# Altium schematic sheet main.SchDoc
size A4; SheetNumber: 1; SheetTotal: 1
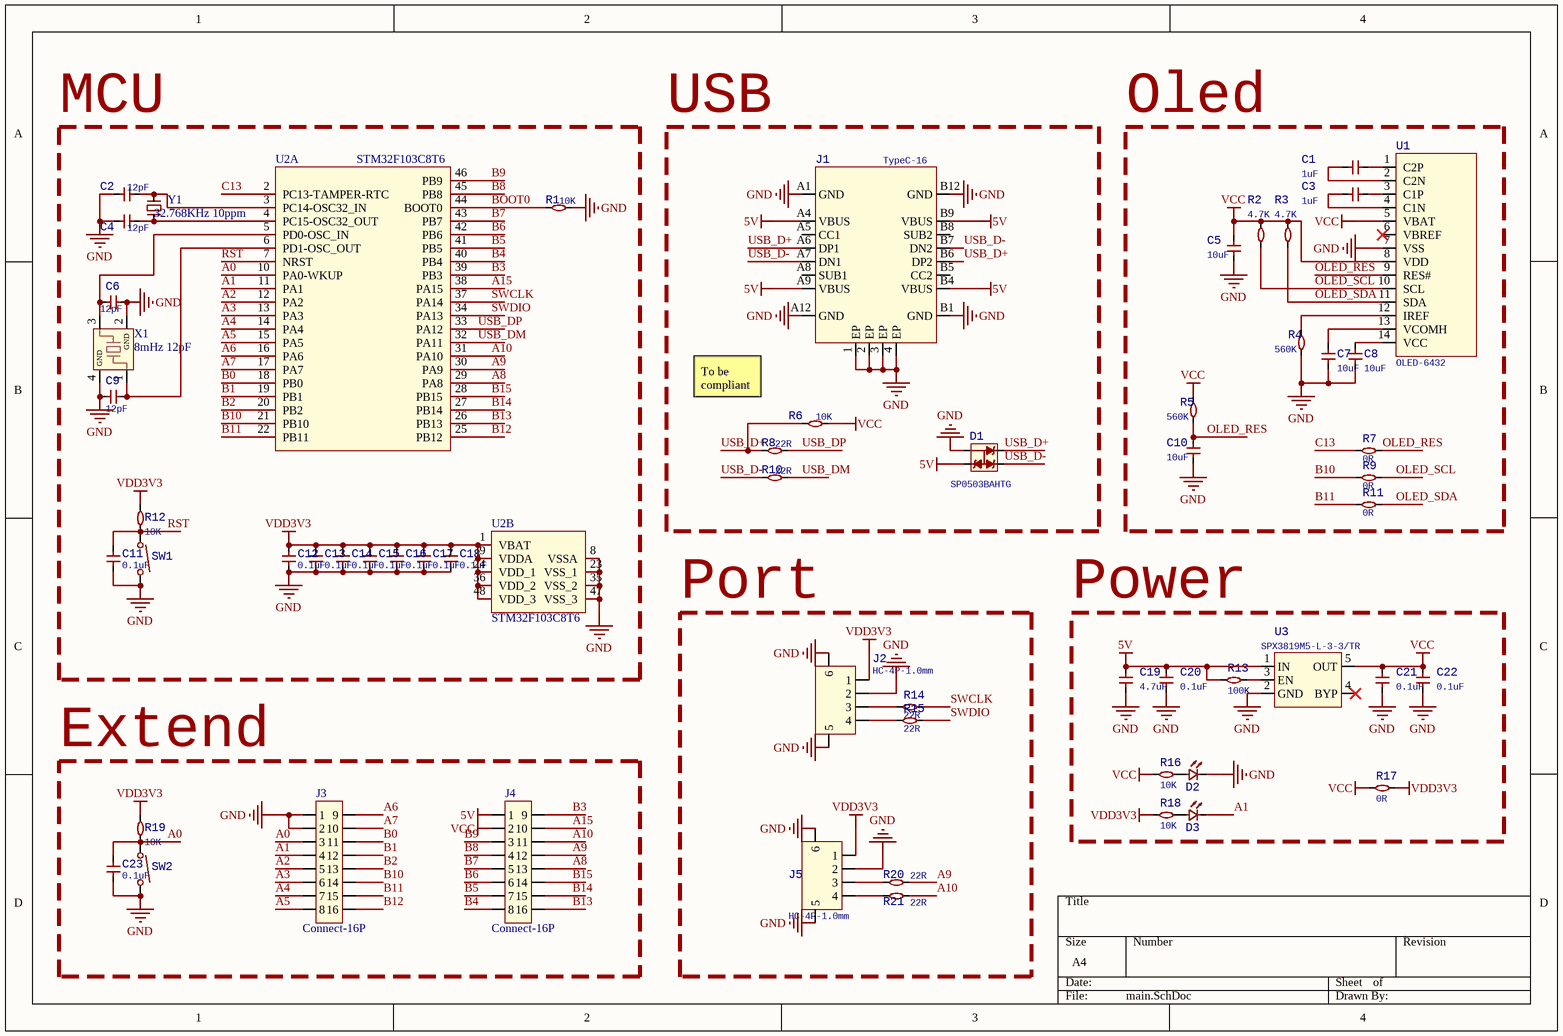
[diagram p0: main.SchDoc]

## Parts
C1  1uF  [C0402]
C2  12pF  [C0402]
C3  1uF  [C0402]
C4  12pF  [C0402]
C5  10uF  [C0402]
C6  12pF  [C0402]
C7  10uF  [C0402]
C8  10uF  [C0402]
C9  12pF  [C0402]
C10  10uF  [C0402]
C11  0.1uF  [C0402]
C12  0.1uF  [C0402]
C13  0.1uF  [C0402]
C14  0.1uF  [C0402]
C15  0.1uF  [C0402]
C16  0.1uF  [C0402]
C17  0.1uF  [C0402]
C18  0.1uF  [C0402]
C19  4.7uF  [C0402]
C20  0.1uF  [C0402]
C21  0.1uF  [C0402]
C22  0.1uF  [C0402]
C23  0.1uF  [C0402]
D1  SP0503BAHTG  [SOT-143]
D2  LED  [LED-0402]  (value not drawn)
D3  LED  [LED-0402]  (value not drawn)
J1  TypeC-16  [USB-SMD_TYPE-C-16P]
J2  HC-4P-1.0mm  [SMD_4P_HC-1.0]
J3  Connect-16P  [PIN-16P]
J4  Connect-16P  [PIN-16P]
J5  HC-4P-1.0mm  [SMD_4P_HC-1.0]
R1  10K  [R0402]
R2  4.7K  [R0402]
R3  4.7K  [R0402]
R4  560K  [R0402]
R5  560K  [R0402]
R6  10K  [R0402]
R7  0R  [R0402]
R8  22R  [R0402]
R9  0R  [R0402]
R10  22R  [R0402]
R11  0R  [R0402]
R12  10K  [R0402]
R13  100K  [R0402]
R14  22R  [R0402]
R15  22R  [R0402]
R16  10K  [R0402]
R17  0R  [R0402]
R18  10K  [R0402]
R19  10K  [R0402]
R20  22R  [R0402]
R21  22R  [R0402]
SW1  3*4两脚按键  [SW-SMD_L4.0-W2.9]  (value not drawn)
SW2  3*4两脚按键  [SW-SMD_L4.0-W2.9]  (value not drawn)
U1  OLED-6432  [OLED-0.96-128x64]
U2  STM32F103C8T6  [LQFP-48_L7.0-W7.0-P0.50]  (parts A,B of 2)
U3  SPX3819M5-L-3-3/TR  [SOT-23-5]
X1  8mHz 12pF  [SMD2016-4P]
Y1  32.768KHz 10ppm  [SMD_2012-2P]

## Blocks framed on the sheet
MCU: C2 C4 C6 C9 C11-C18 R1 R12 SW1 U2 X1 Y1
USB: D1 J1 R6 R8 R10
Oled: C1 C3 C5 C7 C8 C10 R2-R5 R7 R9 R11 U1
Port: J2 J5 R14 R15 R20 R21
Power: C19-C22 D2 D3 R13 R16-R18 U3
Extend: C23 J3 J4 R19 SW2

## Nets
5V: C19.1 C20.1 D1.2 J1.A4(VBUS) J1.A9(VBUS) J1.B4(VBUS) J1.B9(VBUS) J4.1 R13.2 U3.1(IN)
GND: C2.2 C4.2 C5.2 C6.1 C7.2 C8.2 C9.2 C10.2 C11.1 C12.1 C13.1 C14.1 C15.1 C16.1 C17.1 C18.1 C19.2 C20.2 C21.2 C22.2 C23.1 D1.1 D2.1 J1.1(EP) J1.2(EP) J1.3(EP) J1.4(EP) J1.A1(GND) J1.A12(GND) J1.B1(GND) J1.B12(GND) J2.2 J2.5 J2.6 J3.1 J3.2 J5.2 J5.5 J5.6 R1.1 R4.1 SW1.2 SW2.2 U1.7(VSS) U2.8(VSSA) U2.23(VSS_1) U2.35(VSS_2) U2.47(VSS_3) U3.2(GND) X1.2(GND) X1.4(GND)
VCC: C5.1 C21.1 C22.1 J4.2 R2.2 R3.2 R5.2 R6.2 R16.1 R17.1 U1.5(VBAT) U1.8(VDD) U3.5(OUT)
VDD3V3: C12.2 C13.2 C14.2 C15.2 C16.2 C17.2 C18.2 J2.1 J5.1 R12.2 R17.2 R18.1 R19.2 U2.1(VBAT) U2.9(VDDA) U2.24(VDD_1) U2.36(VDD_2) U2.48(VDD_3)
A0: C23.2 J3.3 R19.1 SW2.1 U2.10(PA0-WKUP)
A1: D3.1 J3.4 U2.11(PA1)
A2: J3.5 U2.12(PA2)
A3: J3.6 U2.13(PA3)
A4: J3.7 U2.14(PA4)
A5: J3.8 U2.15(PA5)
A6: J3.9 U2.16(PA6)
A7: J3.10 U2.17(PA7)
A8: J4.13 U2.29(PA8)
A9: J4.12 R20.2 U2.30(PA9)
A10: J4.11 R21.2 U2.31(PA10)
A15: J4.10 U2.38(PA15)
B0: J3.11 U2.18(PB0)
B1: J3.12 U2.19(PB1)
B2: J3.13 U2.20(PB2)
B3: J4.9 U2.39(PB3)
B4: J4.8 U2.40(PB4)
B5: J4.7 U2.41(PB5)
B6: J4.6 U2.42(PB6)
B7: J4.5 U2.43(PB7)
B8: J4.4 U2.45(PB8)
B9: J4.3 U2.46(PB9)
B10: J3.14 R9.2 U2.21(PB10)
B11: J3.15 R11.2 U2.22(PB11)
B12: J3.16 U2.25(PB12)
B13: J4.16 U2.26(PB13)
B14: J4.15 U2.27(PB14)
B15: J4.14 U2.28(PB15)
BOOT0: R1.2 U2.44(BOOT0)
C13: R7.2 U2.2(PC13-TAMPER-RTC)
OLED_RES: C10.1 R5.1 R7.1 U1.9(RES#)
OLED_SCL: R2.1 R9.1 U1.10(SCL)
OLED_SDA: R3.1 R11.1 U1.11(SDA)
RST: C11.2 R12.1 SW1.1 U2.7(NRST)
SWCLK: R14.2 U2.37(PA14)
SWDIO: R15.2 U2.34(PA13)
USB_D+: D1.4 J1.A6(DP1) J1.B6(DP2) R6.1 R8.1
USB_D-: D1.3 J1.A7(DN1) J1.B7(DN2) R10.1
USB_DM: R10.2 U2.32(PA11)
USB_DP: R8.2 U2.33(PA12)
NetC1_1: C1.1 U1.1(C2P)
NetC1_2: C1.2 U1.2(C2N)
NetC2_1: C2.1 U2.3(PC14-OSC32_IN) Y1.2
NetC3_1: C3.1 U1.3(C1P)
NetC3_2: C3.2 U1.4(C1N)
NetC4_1: C4.1 U2.4(PC15-OSC32_OUT) Y1.1
NetC6_2: C6.2 U2.5(PD0-OSC_IN) X1.3
NetC7_1: C7.1 U1.13(VCOMH)
NetC8_1: C8.1 U1.14(VCC)
NetC9_1: C9.1 U2.6(PD1-OSC_OUT) X1.1
NetD2_2: D2.2 R16.2
NetD3_2: D3.2 R18.2
NetJ2_3: J2.3 R14.1
NetJ2_4: J2.4 R15.1
NetJ5_3: J5.3 R20.1
NetJ5_4: J5.4 R21.1
NetR4_2: R4.2 U1.12(IREF)
NetR13_1: R13.1 U3.3(EN)

Not connected (* = marked no-connect by the designer): J1 A5(CC1) A8(SUB1) B5(CC2) B8(SUB2); U1 6(VBREF)*; U3 4(BYP)*

## Notes on the sheet
- To be compliant with the USB 2.0 full-speed electrical specification, the USBDP (D+) pin must be pulled up
  with a 1.5 kΩ resistor to a 3.0 to 3.6 V voltage range.

## Library data of the parts
C1-C23 = CAP: 贴片电容; Manufacturer: SAMSUNG(三星); Manufacturer Part: CL05A105KP5NNND; Add into BOM: yes; Tolerance: ±10%; Voltage Rated: 10V; Temperature Coefficient: X5R; Symbol: CAP-0402; Device: cap-0402; LCSC Part Name: 1uF ±10% 10V; Supplier Part: C307414; Supplier Footprint: 0402; JLCPCB Part Class: Extended Part; Datasheet: https://atta.szlcsc.com/upload/public/pdf/source/20181009/C307414_0A02B57115E94FED95F0CB1E32115BFC.pdf; Supplier: LCSC; Convert to PCB: yes
D1 = SP0503BAHTG: USB-三组 瞬态移植二极管
D2 D3 = LED: 贴片发光二极管; Manufacturer: SAMSUNG(三星); Manufacturer Part: CL05A105KP5NNND; Add into BOM: yes; Tolerance: ±10%; Voltage Rated: 10V; Temperature Coefficient: X5R; Symbol: CAP-0402; Device: cap-0402; LCSC Part Name: 1uF ±10% 10V; Supplier Part: C307414; Supplier Footprint: 0402; JLCPCB Part Class: Extended Part; Datasheet: https://atta.szlcsc.com/upload/public/pdf/source/20181009/C307414_0A02B57115E94FED95F0CB1E32115BFC.pdf; Supplier: LCSC; Convert to PCB: yes
J1 = TypeC-16P: Type-C母座; 触点数量:16; Manufacturer: kinghelm(金航标); Symbol: KH-TYPE-C-16P; Add into BOM: yes; Connector Type: Type-C; Gender: 母座; Number of Contacts: 16; Number of Ports: 1; Current Rating - Power (Max): 3A; LCSC Part Name: Type-C 母座 卧贴; Supplier Part: C709357; Manufacturer Part: KH-TYPE-C-16P; Supplier Footprint: SMD; Datasheet: https://atta.szlcsc.com/upload/public/pdf/source/20200911/C709357_AA8DCEB38BB20E3035A7ED7AE7667837.pdf; Supplier: LCSC; Convert to PCB: yes; Standard: -; Mounting Style: 卧贴; Operating Temperature Range: -40~+85; JLCPCB Part Class: Extended Part
J2 J5 = HC-4P-1.0mm: 线对板连接器
J3 J4 = Connect-16P: 通用连接器
R1-R21 = RES: 贴片电阻; Manufacturer: UNI-ROYAL(厚声); Manufacturer Part: 0402WGF1001TCE; Add into BOM: yes; Tolerance: ±1%; Power(Watts): 1/16W; Temperature Coefficient: ±100ppm/; Overload Voltage (Max): 50V; Symbol: RES-0402; Device: res-0402; LCSC Part Name: 1k ±1%; Supplier Part: C11702; Supplier Footprint: 0402; Datasheet: https://atta.szlcsc.com/upload/public/pdf/source/20200306/C422600_1E6D84923E4A46A82E41ADD87F860B5C.pdf; Supplier: LCSC; Convert to PCB: yes; Type: 厚膜电阻; Operating Temperature Range: -55~+155; JLCPCB Part Class: 基础库
SW1 SW2 = Switch: 3*4两脚贴片不带柱; Manufacturer: BRIGHT(博瑞泰); Symbol: TSA343G00-250J2; Device: 3*4两脚按键不带柱; Add into BOM: yes; Contact Current: 50mA; Voltage Rating (DC): 12V; Insulation Resistance: 100M; Circuit: 单刀单掷; Actuator Style: 圆形按钮; Actuator/Cap Color: 黑色; With Lamp: 无; Operating Force: 250gf@±50gf; Mechanical Life: 50000; Pin Style: SMD接片; Switch Length: 3.95mm; Switch Width: 2.9mm; Switch Height: 2mm; Strike Gundam: 否; LCSC Part Name: 3*4 两脚小龟不带柱  250gf; Supplier Part: C354946; Manufacturer Part: TSA343G00-250J2; Supplier Footprint: SMD; Datasheet: https://atta.szlcsc.com/upload/public/pdf/source/20190426/C354946_6B70DFBDFA823D17B8EB46FB9599F693.pdf; Supplier: LCSC; Convert to PCB: yes; Mounting Style: 立贴; Operating Temperature: -25~+70; JLCPCB Part Class: Extended Part
U1 = OLED
U2 = STM32F103C8T6: CPU最大主频：72MHz / RAM：20KB / FLASH：64KB
U3 = SPX3819M5-L-3-3/TR: LDO输入电压:16V;输出电压:3.3V; Manufacturer: MaxLinear; Add into BOM: yes; Output Type: 固定; Output Polarity: 正; Number of Outputs: 1; Maximum Input Voltage: 16V; Output Voltage: 3.3V; Dropout Voltage: 700mV@(500mA); Output Current: 500mA; Power Supply Rejection Ratio (PRSS): 70dB; Symbol: SPX3819M5-L-3-3/TR; LCSC Part Name: Vin=16V Vout=3.3V 500mA 70dB; Supplier Part: C9055; Manufacturer Part: SPX3819M5-L-3-3/TR; Supplier Footprint: SOT-23-5; Datasheet: https://atta.szlcsc.com/upload/public/pdf/source/20160421/1461205045150.pdf; Supplier: LCSC; Convert to PCB: yes; JLCPCB Part Class: Extended Part
X1 = XTAL: 无源晶振  频率公差：±10ppm
Y1 = XTAL-2P: 无源晶振  频率公差：±10ppm